# EasyEDA Pro project ProPrj_4足轮足机器蜘蛛_2024-09-02.epro, schematic 驱动板
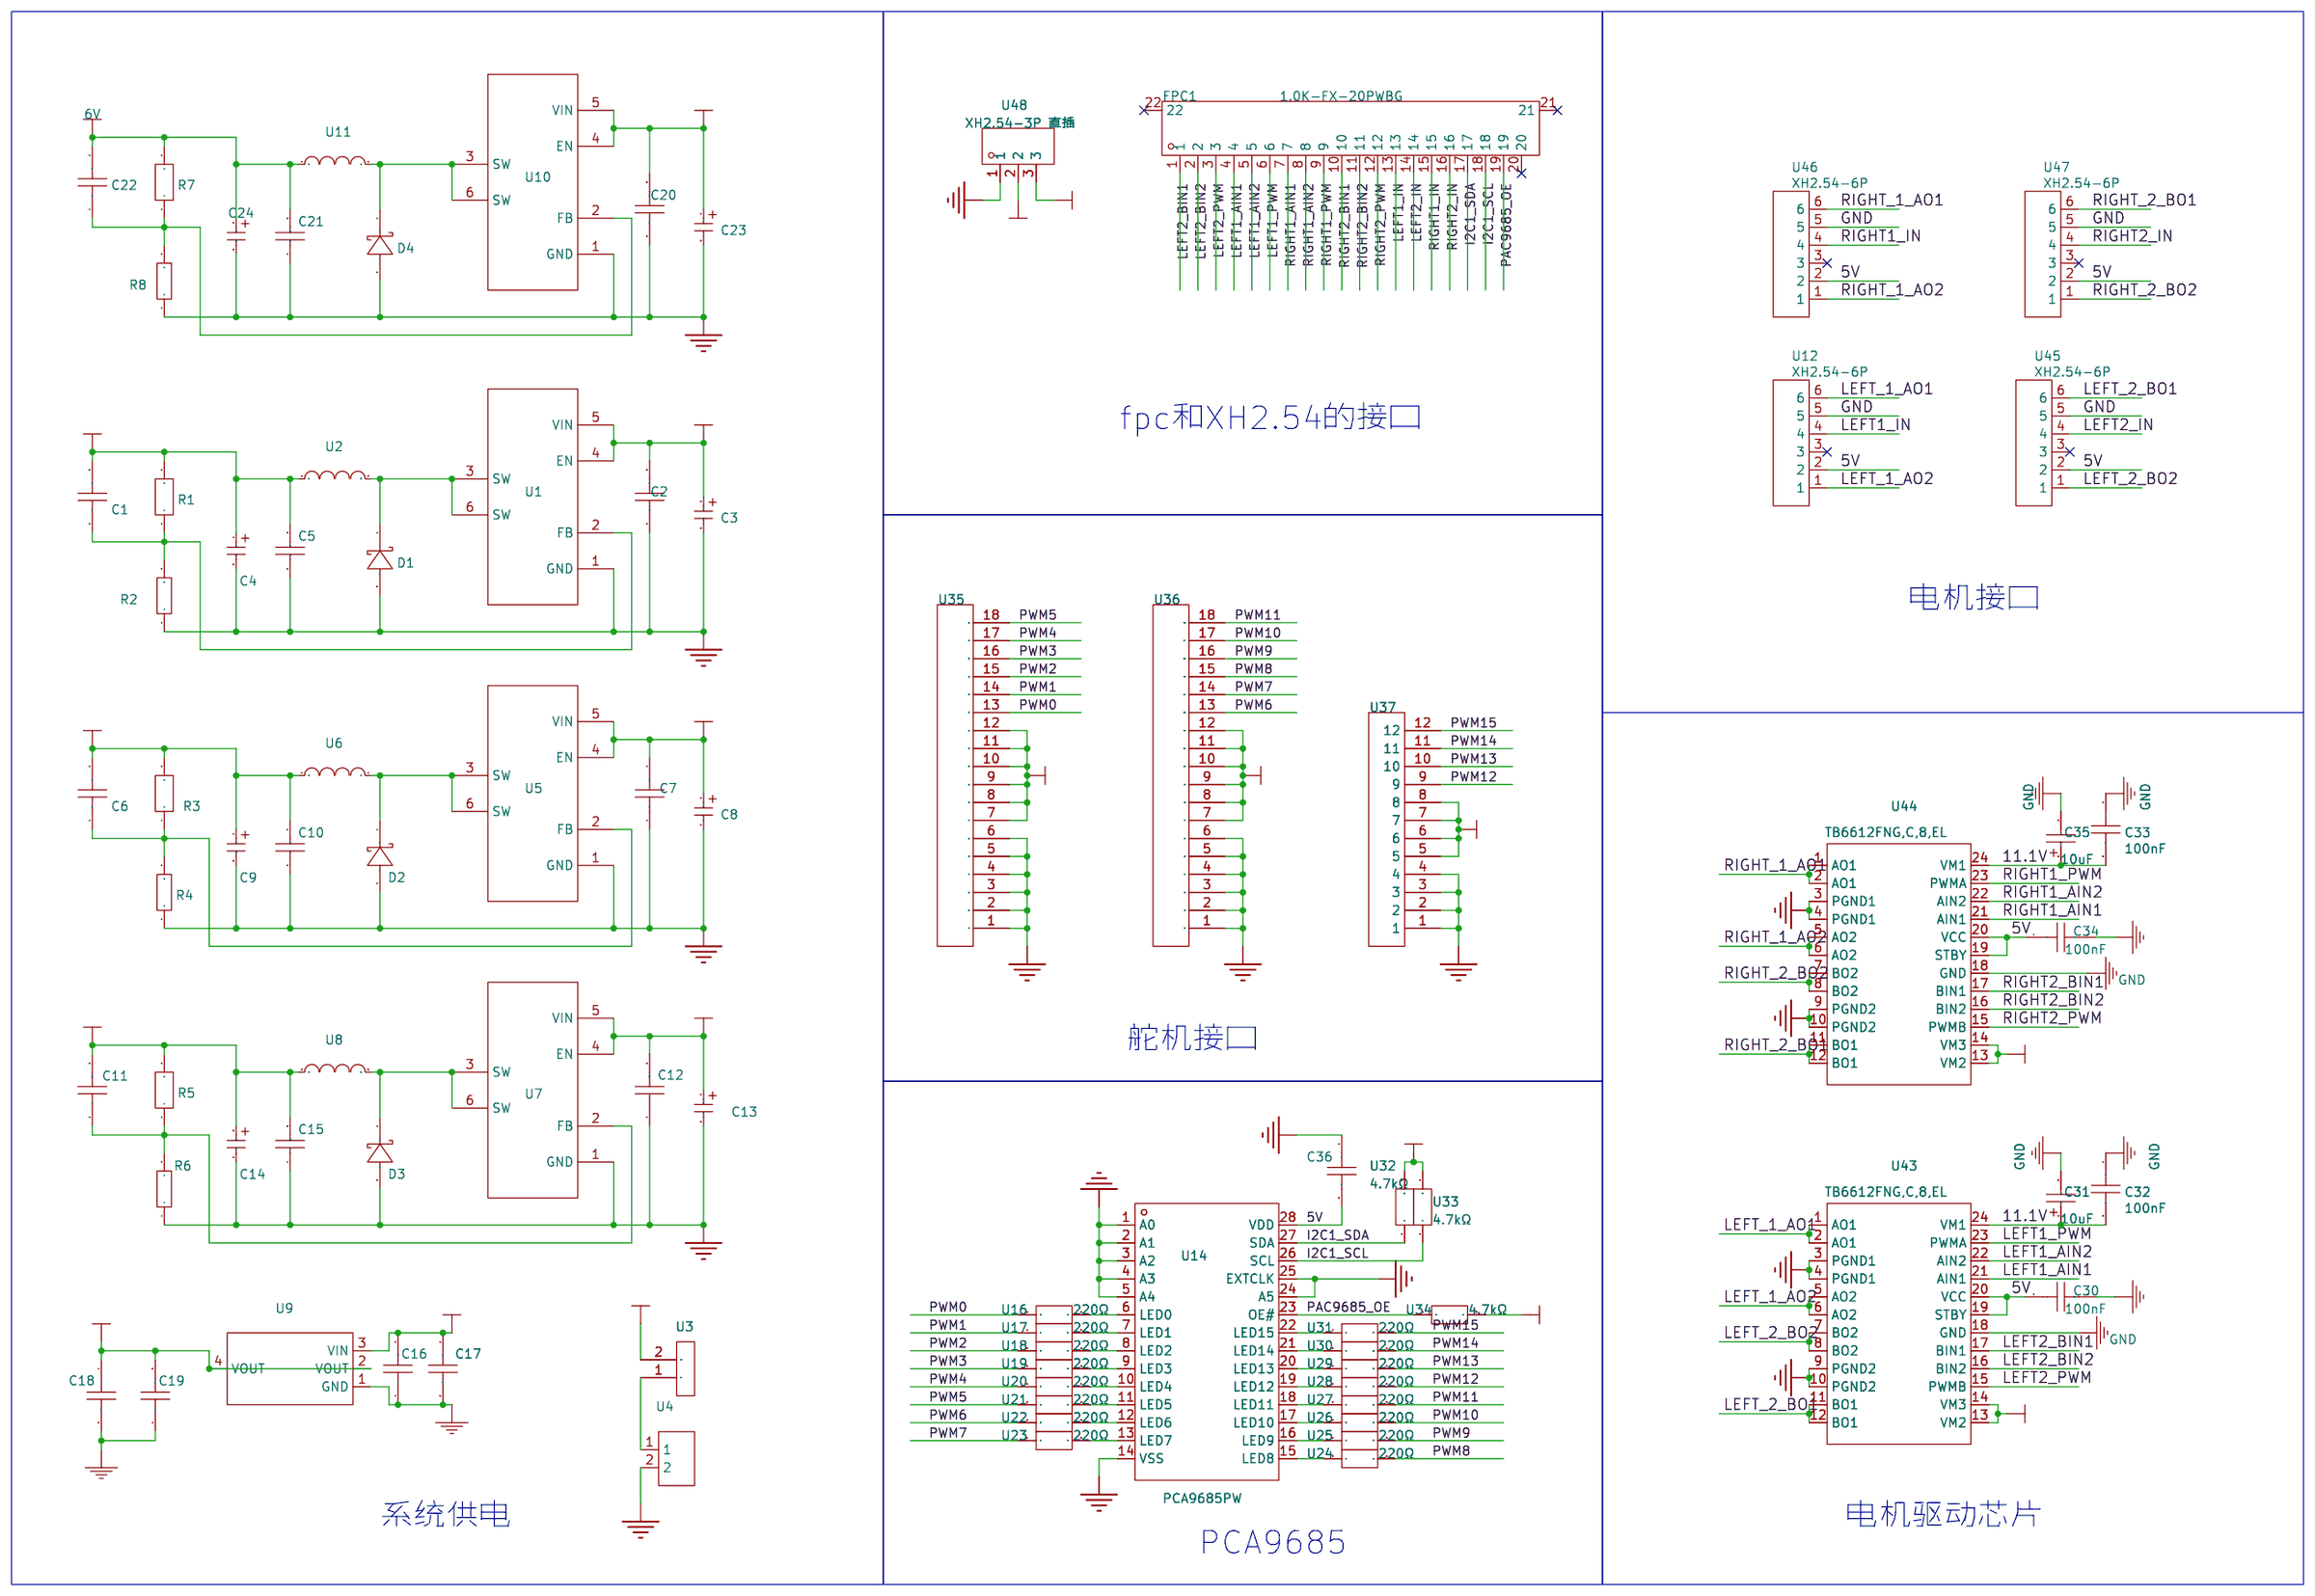
[diagram p1: schematic sheet]

## Parts
C1  33nF  [C0603]
C2  1uF  [C0603]
C3  贴片型铝电解电容  [SMD,8X10.5MM]
C4  贴片型铝电解电容  [SMD,8X10.5MM]
C5  1uF  [C0603]
C6  33nF  [C0603]
C7  1uF  [C0603]
C8  贴片型铝电解电容  [SMD,8X10.5MM]
C9  贴片型铝电解电容  [SMD,8X10.5MM]
C10  1uF  [C0603]
C11  33nF  [C0603]
C12  1uF  [C0603]
C13  贴片型铝电解电容  [SMD,8X10.5MM]
C14  贴片型铝电解电容  [SMD,8X10.5MM]
C15  1uF  [C0603]
C16  10uF  [C0603]
C17  100nF  [C0603]
C18  100nF  [C0603]
C19  10uF  [C0603]
C20  1uF  [C0603]
C21  1uF  [C0603]
C22  33nF  [C0603]
C23  贴片型铝电解电容  [SMD,8X10.5MM]
C24  贴片型铝电解电容  [SMD,8X10.5MM]
C30  100nF  [C0603]
C31  10uF  [CAP-SMD_L3.5-W2.8-R-RD]
C32  100nF  [C0603]
C33  100nF  [C0603]
C34  100nF  [C0603]
C35  10uF  [CAP-SMD_L3.5-W2.8-R-RD]
C36  100nF  [C0603]
D1  SS1045-SMB  [SMB_L4.4-W3.6-LS5.3-RD]
D2  SS1045-SMB  [SMB_L4.4-W3.6-LS5.3-RD]
D3  SS1045-SMB  [SMB_L4.4-W3.6-LS5.3-RD]
D4  SS1045-SMB  [SMB_L4.4-W3.6-LS5.3-RD]
FPC1  1.0K-FX-20PWBG  [FPC-SMD_20P-P1.00-HDGE_1.0K-FX-20PWBG]
R1  21kΩ  [R0603]
R2  3kΩ  [R0603]
R3  21kΩ  [R0603]
R4  3kΩ  [R0603]
R5  16kΩ  [R0603]
R6  3kΩ  [R0603]
R7  21kΩ  [R0603]
R8  3kΩ  [R0603]
U1  XL4005E1  [TO-263-5_L10.2-W9.2-P1.70-TL]
U2  33uH/5A  [IND-SMD_L7.0-W7.0_SLF7055T]
U3  船型开关接口  [两个焊盘]
U4  XT60UPB-F  [CONN-TH_XT60UPB-F]
U5  XL4005E1  [TO-263-5_L10.2-W9.2-P1.70-TL]
U6  33uH/5A  [IND-SMD_L7.0-W7.0_SLF7055T]
U7  XL4005E1  [TO-263-5_L10.2-W9.2-P1.70-TL]
U8  33uH/5A  [IND-SMD_L7.0-W7.0_SLF7055T]
U9  AMS1117-3.3  [SOT-223-3_L6.5-W3.4-P2.30-LS7.0-BR]
U10  XL4005E1  [TO-263-5_L10.2-W9.2-P1.70-TL]
U11  33uH/5A  [IND-SMD_L7.0-W7.0_SLF7055T]
U12  XH2.54-6P  [CONN-TH_XH2.54-6P]
U14  PCA9685PW  [TSSOP-28_L9.7-W4.4-P0.65-LS6.4-BL]
U16  220Ω  [R0603]
U17  220Ω  [R0603]
U18  220Ω  [R0603]
U19  220Ω  [R0603]
U20  220Ω  [R0603]
U21  220Ω  [R0603]
U22  220Ω  [R0603]
U23  220Ω  [R0603]
U24  220Ω  [R0603]
U25  220Ω  [R0603]
U26  220Ω  [R0603]
U27  220Ω  [R0603]
U28  220Ω  [R0603]
U29  220Ω  [R0603]
U30  220Ω  [R0603]
U31  220Ω  [R0603]
U32  4.7kΩ  [R0603]
U33  4.7kΩ  [R0603]
U34  4.7kΩ  [R0603]
U35  -  [HX2.54MM-3X6PIN]
U36  -  [HX2.54MM-3X6PIN]
U37  -  [XH2.54MM-3X4P]
U43  TB6612FNG,C,8,EL  [SSOP-24_L8.3-W5.6-P0.65-LS7.6-BL]
U44  TB6612FNG,C,8,EL  [SSOP-24_L8.3-W5.6-P0.65-LS7.6-BL]
U45  XH2.54-6P  [CONN-TH_XH2.54-6P]
U46  XH2.54-6P  [CONN-TH_XH2.54-6P]
U47  XH2.54-6P  [CONN-TH_XH2.54-6P]
U48  XH2.54-3P 直插  [CONN-TH_XH2.54-3P]

## Library data of the parts
C1 C6 C11 C22 = 33nF: Supplier: LCSC; Supplier Part: C2835547; Manufacturer: SANYEAR(叁叶源); Manufacturer Part: C0603X7R333J500NT; JLCPCB Part Class: Extended Part
C2 C7 C12 C20 = 1uF: Supplier: LCSC; Supplier Part: C105504; Manufacturer: Walsin(华新科); Manufacturer Part: 0603X105K160CT; JLCPCB Part Class: Extended Part
C3 C8 C13 C23 = 220uF/35V
C4 C9 C14 C24 = 330uF/16V: Comment: 220uF/35V
C5 C10 C15 C21 = 1uF: Supplier: LCSC; Manufacturer: YAGEO(国巨); Manufacturer Part: CC0805ZRY5V8BB105; Supplier Part: C106837; JLCPCB Part Class: Extended Part
C16 C19 = 10uF: Supplier: LCSC; Supplier Part: C7472959; Manufacturer: Chinocera(华瓷); Manufacturer Part: HGC0603R5106M160NTHJ; JLCPCB Part Class: Extended Part
C17 C18 C30 C32-C34 C36 = 100nF: Supplier: LCSC; Supplier Part: C346189; Manufacturer: SAMSUNG(三星); Manufacturer Part: CL10B104KA8NFNC; JLCPCB Part Class: Extended Part
C31 C35 = 10uF: Supplier: LCSC; Manufacturer: Sunlord(顺络); Manufacturer Part: TC212B106M016B; Supplier Part: C124852; JLCPCB Part Class: Extended Part
D1-D4 = SS1045-SMB: Supplier: LCSC; Supplier Part: C2903947; Manufacturer: GOODWORK(固得沃克); JLCPCB Part Class: Extended Part
FPC1 = 1.0K-FX-20PWBG: 锁定特性:抽屉式;触点类型:下接;触点数量:20P;间距:1mm;安装类型:卧贴;工作温度范围:-20℃~+85℃;; LCSC Part Name: 间距:1mm P数:20P 抽屉式 下接; Supplier Part: C2914107; Manufacturer: HDGC(华德共创); Supplier Footprint: SMD,P=1mm,卧贴; JLCPCB Part Class: 扩展库; Datasheet: https://atta.szlcsc.com/upload/public/pdf/source/20211102/FBD3A65A951C668C1EEFFBD9B352F09A.pdf; Supplier: LCSC; Locking Feature: 抽屉式; Contact Type: 下接; Number of Contacts: 20P; Pitch: 1mm; Mounting Type: 卧贴; FFC, FCB Thickness: 0.3mm; Height Above Board: 2.5mm; Operating Temperature Range: -20℃~+85℃
R1 R3 R7 = 21kΩ: Supplier: LCSC; Supplier Part: C782232; Manufacturer: KOA; Manufacturer Part: RN73H1JTTD1003B25
R2 R4 R6 R8 = 3kΩ: Supplier: LCSC; Manufacturer: UNI-ROYAL(厚声); Manufacturer Part: 0603WAF4301T5E; Supplier Part: C23159
R5 = 16kΩ: Supplier: LCSC; Supplier Part: C782232; Manufacturer: KOA; Manufacturer Part: RN73H1JTTD1003B25
U1 U5 U7 U10 = XL4005E1: Supplier: LCSC; Manufacturer: XLSEMI(芯龙); Supplier Part: C73332; JLCPCB Part Class: Extended Part
U2 U6 U8 U11 = 33uH/5A: Supplier: LCSC; Supplier Part: C9900013437; Manufacturer: null; Manufacturer Part: CDRH74R; JLCPCB Part Class: Extended Part
U3 = 船型开关接口
U4 = XT60UPB-F: Supplier: LCSC; Supplier Part: C9900007500; Manufacturer: null; JLCPCB Part Class: Extended Part
U9 = AMS1117-3.3: Supplier: LCSC; Manufacturer: AMS; Supplier Part: C6186; JLCPCB Part Class: Basic Part
U12 U45-U47 = XH2.54-6P: Supplier: LCSC; Supplier Part: C9900000754; Manufacturer: null; Manufacturer Part: XH2.54-6P 直插; JLCPCB Part Class: Extended Part
U14 = PCA9685PW/Q900,118: 类型:-;输入电压:2.3V~5.5V;通道数:16;输出电压:5.5V;输出电流:25mA;调光:PWM;; Supplier Part: C92206; Manufacturer: NXP(恩智浦); Supplier Footprint: TSSOP-28; JLCPCB Part Class: 扩展库; Datasheet: https://atta.szlcsc.com/upload/public/pdf/source/20170908/C92206_1504870161626958140.pdf; Supplier: LCSC; Input Voltage: 2.3V~5.5V; Channels: 16; Output Voltage: 5.5V; Output Current: 25mA; Dimming: PWM; Operating temperature: -40℃~+85℃
U16-U34 = RMCF0603FT11K0: 电阻类型:厚膜电阻;阻值:11kΩ;精度:±1%;功率:100mW;最大工作电压:75V;温度系数:±100ppm/℃;; LCSC Part Name: 厚膜电阻 11kΩ ±1% 100mW; Supplier Part: C2479538; Manufacturer: SEI(Stackpole Electronics Inc.); Supplier Footprint: 0603; Datasheet: https://atta.szlcsc.com/upload/public/pdf/source/20210416/08FD20E6270D8D7CE8DA16B611AFBC44.pdf; Supplier: LCSC; Type: 厚膜电阻; Tolerance: ±1%; Power(Watts): 100mW; Overload Voltage (Max): 75V; Temperature Coefficient: ±100ppm/℃; Operating Temperature Range: -55℃~+155℃
U35 U36 = XH2.54MM-3X6P
U37 = XH2.54MM-3X4P
U43 U44 = TB6612FNG,C,8,EL: Supplier: LCSC; Manufacturer: TOSHIBA(东芝); Supplier Part: C141517; JLCPCB Part Class: Extended Part
U48 = XH2.54-3P 直插: Supplier Part: C9900000727; Supplier Footprint: TH-3_5.8X10.0X2.54P; JLCPCB Part Class: 扩展库; Supplier: LCSC

## Nets
3.3V: C18.1 C19.2 U9.2(VOUT) U9.4(VOUT) U32.2 U33.2 U34.2 U48.2
5V: C11.2 C14.1 C15.2 C16.2 C17.1 C30.1 C34.1 C36.2 R5.2 U8.1 U9.3(VIN) U12.2 U14.28(VDD) U43.19(STBY) U43.20(VCC) U44.19(STBY) U44.20(VCC) U45.2 U46.2 U47.2 U48.3
6V: C21.2 C22.2 C24.1 R7.2 U11.1 U37.5 U37.6 U37.7 U37.8
6V_LEFT: C1.2 C4.1 C5.2 R1.2 U2.1 U35.7 U35.8 U35.9 U35.10 U35.11 U35.12
6V_RIGHT: C6.2 C9.1 C10.2 R3.2 U6.1 U36.7 U36.8 U36.9 U36.10 U36.11 U36.12
11.1V: C2.2 C3.1 C7.2 C8.1 C12.2 C13.1 C20.2 C23.1 C31.1 C32.2 C33.2 C35.1 U1.4(EN) U1.5(VIN) U3.2 U5.4(EN) U5.5(VIN) U7.4(EN) U7.5(VIN) U10.4(EN) U10.5(VIN) U43.13(VM2) U43.14(VM3) U43.24(VM1) U44.13(VM2) U44.14(VM3) U44.24(VM1)
GND: C2.1 C3.2 C4.2 C5.1 C7.1 C8.2 C9.2 C10.1 C12.1 C13.2 C14.2 C15.1 C16.1 C17.2 C18.2 C19.1 C20.1 C21.1 C23.2 C24.2 C30.2 C31.2 C32.1 C33.1 C34.2 C35.2 C36.1 D1.2 D2.2 D3.2 D4.2 R2.1 R4.1 R6.1 R8.1 U1.1(GND) U4.2 U5.1(GND) U7.1(GND) U9.1(GND) U10.1(GND) U12.5 U14.1(A0) U14.2(A1) U14.3(A2) U14.4(A3) U14.5(A4) U14.14(VSS) U14.24(A5) U14.25(EXTCLK) U35.1 U35.2 U35.3 U35.4 U35.5 U35.6 U36.1 U36.2 U36.3 U36.4 U36.5 U36.6 U37.1 U37.2 U37.3 U37.4 U43.3(PGND1) U43.4(PGND1) U43.9(PGND2) U43.10(PGND2) U43.18(GND) U44.3(PGND1) U44.4(PGND1) U44.9(PGND2) U44.10(PGND2) U44.18(GND) U45.5 U46.5 U47.5 U48.1
I2C1_SCL: FPC1.18 U14.26(SCL) U33.1
I2C1_SDA: FPC1.17 U14.27(SDA) U32.1
LEFT1_AIN1: FPC1.4 U43.21(AIN1)
LEFT1_AIN2: FPC1.5 U43.22(AIN2)
LEFT1_IN: FPC1.13 U12.4
LEFT1_PWM: FPC1.6 U43.23(PWMA)
LEFT2_BIN1: FPC1.1 U43.17(BIN1)
LEFT2_BIN2: FPC1.2 U43.16(BIN2)
LEFT2_IN: FPC1.14 U45.4
LEFT2_PWM: FPC1.3 U43.15(PWMB)
LEFT_1_AO1: U12.6 U43.1(AO1) U43.2(AO1)
LEFT_1_AO2: U12.1 U43.5(AO2) U43.6(AO2)
LEFT_2_BO1: U43.11(BO1) U43.12(BO1) U45.6
LEFT_2_BO2: U43.7(BO2) U43.8(BO2) U45.1
PAC9685_OE: FPC1.19 U14.23(OE#) U34.1
PWM0: U16.1 U35.13
PWM1: U17.1 U35.14
PWM2: U18.1 U35.15
PWM3: U19.1 U35.16
PWM4: U20.1 U35.17
PWM5: U21.1 U35.18
PWM6: U22.1 U36.13
PWM7: U23.1 U36.14
PWM8: U24.2 U36.15
PWM9: U25.2 U36.16
PWM10: U26.2 U36.17
PWM11: U27.2 U36.18
PWM12: U28.2 U37.9
PWM13: U29.2 U37.10
PWM14: U30.2 U37.11
PWM15: U31.2 U37.12
RIGHT1_AIN1: FPC1.7 U44.21(AIN1)
RIGHT1_AIN2: FPC1.8 U44.22(AIN2)
RIGHT1_IN: FPC1.15 U46.4
RIGHT1_PWM: FPC1.9 U44.23(PWMA)
RIGHT2_BIN1: FPC1.10 U44.17(BIN1)
RIGHT2_BIN2: FPC1.11 U44.16(BIN2)
RIGHT2_IN: FPC1.16 U47.4
RIGHT2_PWM: FPC1.12 U44.15(PWMB)
RIGHT_1_AO1: U44.1(AO1) U44.2(AO1) U46.6
RIGHT_1_AO2: U44.5(AO2) U44.6(AO2) U46.1
RIGHT_2_BO1: U44.11(BO1) U44.12(BO1) U47.6
RIGHT_2_BO2: U44.7(BO2) U44.8(BO2) U47.1
$2N1308: C11.1 R5.1 R6.2 U7.2(FB)
$2N1309: D3.1 U7.3(SW) U7.6(SW) U8.2
$2N1311: C6.1 R3.1 R4.2 U5.2(FB)
$2N1319: D2.1 U5.3(SW) U5.6(SW) U6.2
$2N1321: C1.1 R1.1 R2.2 U1.2(FB)
$2N1328: D1.1 U1.3(SW) U1.6(SW) U2.2
$2N1329: U3.1 U4.1
$2N2945: D4.1 U10.3(SW) U10.6(SW) U11.2
$2N2946: C22.1 R7.1 R8.2 U10.2(FB)
$2N4931: U14.6(LED0) U16.2
$2N5771: U14.7(LED1) U17.2
$2N5775: U14.8(LED2) U18.2
$2N5780: U14.9(LED3) U19.2
$2N5785: U14.10(LED4) U20.2
$2N5790: U14.11(LED5) U21.2
$2N5795: U14.12(LED6) U22.2
$2N5800: U14.13(LED7) U23.2
$2N5805: U14.22(LED15) U31.1
$2N5810: U14.21(LED14) U30.1
$2N5815: U14.20(LED13) U29.1
$2N5820: U14.19(LED12) U28.1
$2N5825: U14.18(LED11) U27.1
$2N5830: U14.17(LED10) U26.1
$2N5835: U14.16(LED9) U25.1
$2N5840: U14.15(LED8) U24.1

Not connected (* = marked no-connect by the designer): FPC1 20* 21* 22*; U12 3*; U45 3*; U46 3*; U47 3*

## Notes on the sheet
- fpc和XH2.54的接口
- 电机接口
- 舵机接口
- 系统供电
- 电机驱动芯片
- PCA9685
